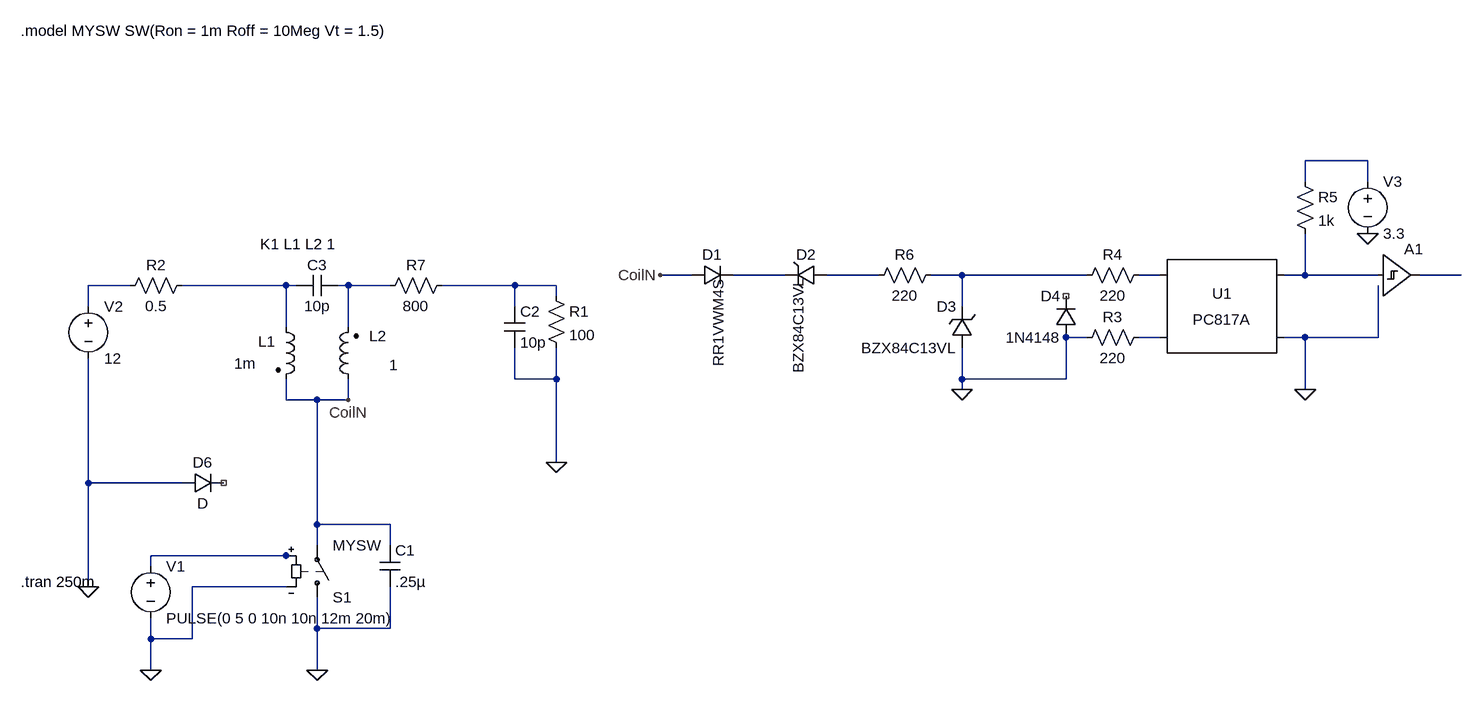
[diagram p0: schematic coil_sim.asc]
coil_sim.asc, the LTspice schematic file:
Version 4
SHEET 1 1748 680
WIRE 1600 -272 1504 -272
WIRE 1504 -240 1504 -272
WIRE 1600 -240 1600 -272
WIRE 560 -96 512 -96
WIRE 704 -96 624 -96
WIRE 848 -96 768 -96
WIRE 976 -96 928 -96
WIRE 1168 -96 976 -96
WIRE 1280 -96 1248 -96
WIRE 1504 -96 1504 -160
WIRE 1504 -96 1472 -96
WIRE 1616 -96 1504 -96
WIRE 1744 -96 1680 -96
WIRE -304 -80 -368 -80
WIRE -64 -80 -224 -80
WIRE -48 -80 -64 -80
WIRE 32 -80 16 -80
WIRE 96 -80 32 -80
WIRE 288 -80 176 -80
WIRE 352 -80 288 -80
WIRE 352 -64 352 -80
WIRE -368 -48 -368 -80
WIRE 288 -48 288 -80
WIRE 976 -48 976 -96
WIRE -64 -16 -64 -80
WIRE 32 -16 32 -80
WIRE 1168 0 1136 0
WIRE 1280 0 1248 0
WIRE 1504 0 1472 0
WIRE 1616 0 1616 -80
WIRE 1616 0 1504 0
WIRE 288 64 288 16
WIRE 352 64 352 16
WIRE 352 64 288 64
WIRE 976 64 976 16
WIRE 1136 64 1136 0
WIRE 1136 64 976 64
WIRE 976 80 976 64
WIRE 1504 80 1504 0
WIRE -64 96 -64 64
WIRE -16 96 -64 96
WIRE 32 96 32 64
WIRE 32 96 -16 96
WIRE 352 192 352 64
WIRE -368 224 -368 32
WIRE -224 224 -368 224
WIRE -16 288 -16 96
WIRE 96 288 -16 288
WIRE -16 320 -16 288
WIRE 96 320 96 288
WIRE -64 336 -272 336
WIRE -48 336 -64 336
WIRE -272 352 -272 336
WIRE -368 384 -368 224
WIRE -64 384 -208 384
WIRE -16 448 -16 400
WIRE 96 448 96 384
WIRE 96 448 -16 448
WIRE -272 464 -272 432
WIRE -208 464 -208 384
WIRE -208 464 -272 464
WIRE -272 512 -272 464
WIRE -16 512 -16 448
FLAG 352 192 0
FLAG -16 512 0
FLAG -272 512 0
FLAG -368 384 0
FLAG 32 96 CoilN
FLAG 512 -96 CoilN
FLAG 976 80 0
FLAG 1600 -160 0
FLAG 1504 80 0
SYMBOL sw -16 416 M180
SYMATTR InstName S1
SYMATTR Value MYSW
SYMBOL ind2 -80 -32 R0
WINDOW 0 -27 38 Left 2
WINDOW 3 -64 72 Left 2
SYMATTR InstName L1
SYMATTR Value 1m
SYMATTR Type ind
SYMBOL ind2 48 80 R180
WINDOW 0 -43 82 Left 2
WINDOW 3 -60 38 Left 2
SYMATTR InstName L2
SYMATTR Value 1
SYMATTR Type ind
SYMATTR SpiceLine Rser=0
SYMBOL res 336 -80 R0
SYMATTR InstName R1
SYMATTR Value 100
SYMBOL voltage -272 336 R0
WINDOW 123 0 0 Left 0
WINDOW 39 0 0 Left 0
SYMATTR InstName V1
SYMATTR Value PULSE(0 5 0 10n 10n 12m 20m)
SYMBOL cap 80 320 R0
SYMATTR InstName C1
SYMATTR Value .25µ
SYMBOL cap 272 -48 R0
SYMATTR InstName C2
SYMATTR Value 10p
SYMBOL res -208 -96 R90
WINDOW 0 0 56 VBottom 2
WINDOW 3 32 56 VTop 2
SYMATTR InstName R2
SYMATTR Value 0.5
SYMBOL voltage -368 -64 R0
WINDOW 123 0 0 Left 0
WINDOW 39 0 0 Left 0
SYMATTR InstName V2
SYMATTR Value 12
SYMBOL diode 560 -80 R270
WINDOW 0 32 32 VTop 2
WINDOW 3 -57 57 Bottom 2
SYMATTR InstName D1
SYMATTR Value RR1VWM4S
SYMBOL zener 768 -112 R90
WINDOW 0 0 32 VBottom 2
WINDOW 3 93 28 Top 2
SYMATTR InstName D2
SYMATTR Value BZX84C13VL
SYMATTR Description Diode
SYMATTR Type diode
SYMBOL zener 992 16 R180
WINDOW 0 24 64 Left 2
WINDOW 3 24 0 Left 2
SYMATTR InstName D3
SYMATTR Value BZX84C13VL
SYMATTR Description Diode
SYMATTR Type diode
SYMBOL res 1264 -112 R90
WINDOW 0 0 56 VBottom 2
WINDOW 3 32 56 VTop 2
SYMATTR InstName R4
SYMATTR Value 220
SYMBOL diode 1152 0 R180
WINDOW 0 24 64 Left 2
WINDOW 3 24 0 Left 2
SYMATTR InstName D4
SYMATTR Value 1N4148
SYMBOL Optos\\PC817A 1376 -48 R0
SYMATTR InstName U1
SYMBOL res 1488 -256 R0
SYMATTR InstName R5
SYMATTR Value 1k
SYMBOL voltage 1600 -256 R0
WINDOW 123 0 0 Left 0
WINDOW 39 0 0 Left 0
SYMATTR InstName V3
SYMATTR Value 3.3
SYMBOL res 944 -112 R90
WINDOW 0 0 56 VBottom 2
WINDOW 3 32 56 VTop 2
SYMATTR InstName R6
SYMATTR Value 220
SYMBOL Digital\\schmtbuf 1616 -160 R0
SYMATTR InstName A1
SYMBOL res 1264 -16 R90
WINDOW 0 0 56 VBottom 2
WINDOW 3 32 56 VTop 2
SYMATTR InstName R3
SYMATTR Value 220
SYMBOL res 192 -96 R90
WINDOW 0 0 56 VBottom 2
WINDOW 3 32 56 VTop 2
SYMATTR InstName R7
SYMATTR Value 800
SYMBOL diode -224 240 R270
WINDOW 0 32 32 VTop 2
WINDOW 3 0 32 VBottom 2
SYMATTR InstName D6
SYMBOL cap 16 -96 R90
WINDOW 0 0 32 VBottom 2
WINDOW 3 32 32 VTop 2
SYMATTR InstName C3
SYMATTR Value 10p
TEXT -472 -472 Left 2 !.model MYSW SW(Ron = 1m Roff = 10Meg Vt = 1.5)
TEXT -104 -144 Left 2 !K1 L1 L2 1
TEXT -472 376 Left 2 !.tran 250m

The netlist it stands for:
* coil_sim.asc
S1 0 CoilN N013 0 MYSW
L1 N009 CoilN 1m
L2 CoilN N010 1 Rser=0
R1 N011 0 100
V1 N013 0 PULSE(0 5 0 10n 10n 12m 20m)
C1 CoilN 0 .25µ
C2 N011 0 10p
R2 N009 N008 0.5
V2 N008 0 12
D1 CoilN N002 RR1VWM4S
D2 N003 N002 BZX84C13VL
D3 0 N004 BZX84C13VL
R4 N005 N004 220
D4 0 NC_01 1N4148
XU1 N005 N012 N006 0 PC817 Igain=1m
R5 N001 N006 1k
V3 N001 0 3.3
R6 N004 N003 220
A1 N006 0 0 0 0 0 N007 0 SCHMITT
R3 N012 0 220
R7 N011 N010 800
D6 0 NC_02 D
C3 N010 N009 10p
.model D D
.lib standard.dio
.model MYSW SW(Ron = 1m Roff = 10Meg Vt = 1.5)
K1 L1 L2 1
.tran 250m
.lib PC817.sub
.backanno
.end